# Altium schematic sheet HAT.SchDoc
size A4; DocumentNumber: 2; SheetNumber: 1; SheetTotal: 2
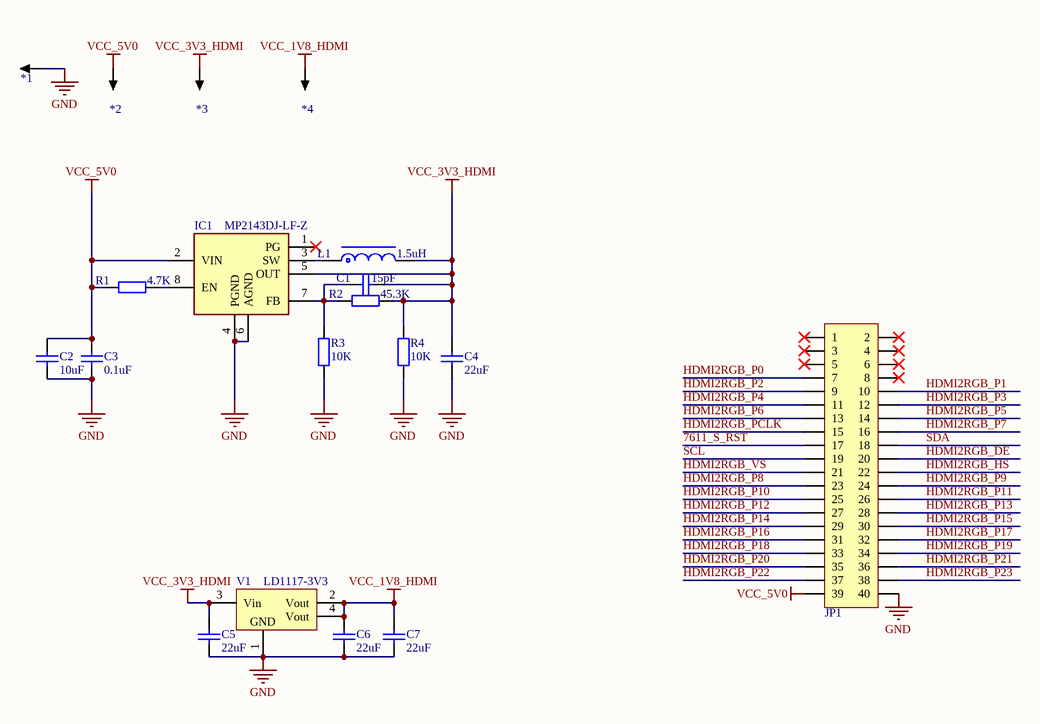
[diagram p0: HAT.SchDoc]

## Parts
*1  CS  [R100]  (value not drawn)
*2  CS  [R100]  (value not drawn)
*3  CS  [R100]  (value not drawn)
*4  CS  [R100]  (value not drawn)
C1  15pF  [C0402_L]
C2  10uF  [C0805_L]
C3  0.1uF  [C0402_L]
C4  22uF  [C0805_L]
C5  22uF  [C0603_L]
C6  22uF  [C0603_L]
C7  22uF  [C0805_L]
IC1  MP2143DJ-LF-Z  [SOP65P280X100-8N]
JP1  Header 2X11  [PHD2.0-LI-2x20P]  (value not drawn)
L1  1.5uH  [NR3010]
R1  4.7K  [R0402_L]
R2  45.3K  [R0402_L]
R3  10K  [R0402_L]
R4  10K  [R0402_L]
V1  LD1117-3V3  [SOT223_L]

## Nets
GND: *1.1 C2.1 C3.1 C4.1 C5.1 C6.1 C7.1 IC1.4(PGND) IC1.6(AGND) JP1.40 R3.1 R4.1 V1.1(GND)
VCC_1V8_HDMI: *4.1 C6.2 C7.2 V1.2(Vout) V1.4(Vout)
VCC_3V3_HDMI: *3.1 C1.1 C4.2 C5.2 IC1.5(OUT) L1.2 R2.1 R4.2 V1.3(Vin)
VCC_5V0: *2.1 C2.2 C3.2 IC1.2(VIN) JP1.39 R1.2
7611_S_RST: JP1.17
HDMI2RGB_DE: JP1.20
HDMI2RGB_HS: JP1.22
HDMI2RGB_P0: JP1.7
HDMI2RGB_P1: JP1.10
HDMI2RGB_P2: JP1.9
HDMI2RGB_P3: JP1.12
HDMI2RGB_P4: JP1.11
HDMI2RGB_P5: JP1.14
HDMI2RGB_P6: JP1.13
HDMI2RGB_P7: JP1.16
HDMI2RGB_P8: JP1.23
HDMI2RGB_P9: JP1.24
HDMI2RGB_P10: JP1.25
HDMI2RGB_P11: JP1.26
HDMI2RGB_P12: JP1.27
HDMI2RGB_P13: JP1.28
HDMI2RGB_P14: JP1.29
HDMI2RGB_P15: JP1.30
HDMI2RGB_P16: JP1.31
HDMI2RGB_P17: JP1.32
HDMI2RGB_P18: JP1.33
HDMI2RGB_P19: JP1.34
HDMI2RGB_P20: JP1.35
HDMI2RGB_P21: JP1.36
HDMI2RGB_P22: JP1.37
HDMI2RGB_P23: JP1.38
HDMI2RGB_PCLK: JP1.15
HDMI2RGB_VS: JP1.21
SCL: JP1.19
SDA: JP1.18
NetC1_2: C1.2 IC1.7(FB) R2.2 R3.2
NetIC1_3: IC1.3(SW) L1.1
NetIC1_8: IC1.8(EN) R1.1

Not connected (* = marked no-connect by the designer): IC1 1(PG)*; JP1 1* 2* 3* 4* 5* 6* 8*

## Library data of the parts
*1-*4 = CS: 探针焊盘; 联系卖家，免费查找封装: 唯一出售店铺网址https://shop463601444.taobao.com; BOM名称: 探针焊盘
C1-C7 = C: 贴片电容; BOM名称: 无极性贴片电容; 联系卖家，免费查找封装: 唯一出售店铺网址https://shop463601444.taobao.com
IC1 = MP2143DJ-LF-Z: Integrated Circuit; Manufacturer_Name: Monolithic Power Systems (MPS); Datasheet Link: https://www.mouser.com/ds/2/277/MP2143_r1.07-371732.pdf; Height: 1mm; Manufacturer_Part_Number: MP2143DJ-LF-Z; Mouser Part Number: 946-MP2143DJLFZ; Mouser Price/Stock: https://www.mouser.co.uk/ProductDetail/Monolithic-Power-Systems-MPS/MP2143DJ-LF-Z?qs=QEkzKklKf2Sh6e0cSbvEyA%3D%3D
JP1 = Header 20X2: 20*2P接插件; 封装库来自淘宝卖家 ID：黄晶宝石: 其他店铺购入均为盗版假冒封装库; BOM名称: 20*2P接插件
L1 = L-NR: 太诱-NR磁胶电感; 0.0_BOM名称: NR磁胶电感; 3.交流分享: Q群514746572,开源更新,欢迎一起交流学习PCB设计; 4.作者声明: 旨为整合最全库集,欢迎转载,禁止商用！-冰凌猫; 5.备注说明: 该库已二次整合过网上各热销库,基本最全,无需重复搜购安装; 1.库作者: 冰凌猫; 2.库版本: v2.0 (2021.03.30)
R1-R4 = R: 贴片电阻; 联系卖家，免费查找封装: 唯一出售店铺网址https://shop463601444.taobao.com; 封装库来自淘宝卖家ID：黄晶宝石: 其他店铺购入均为盗版假冒封装库，请立即申请退款; BOM名称: 贴片电阻
V1 = LD1117: 三端稳压芯片; BOM名称: 稳压芯片; 封装库来自淘宝卖家 ID：黄晶宝石: 其他店铺购入均为盗版，请立即申请退款，本店现金奖励5~20元; 联系卖家 免费查找封装: 唯一出售店铺网址https://shop463601444.taobao.com